# EAGLE design timer_rele (EAGLE 7.2.0)
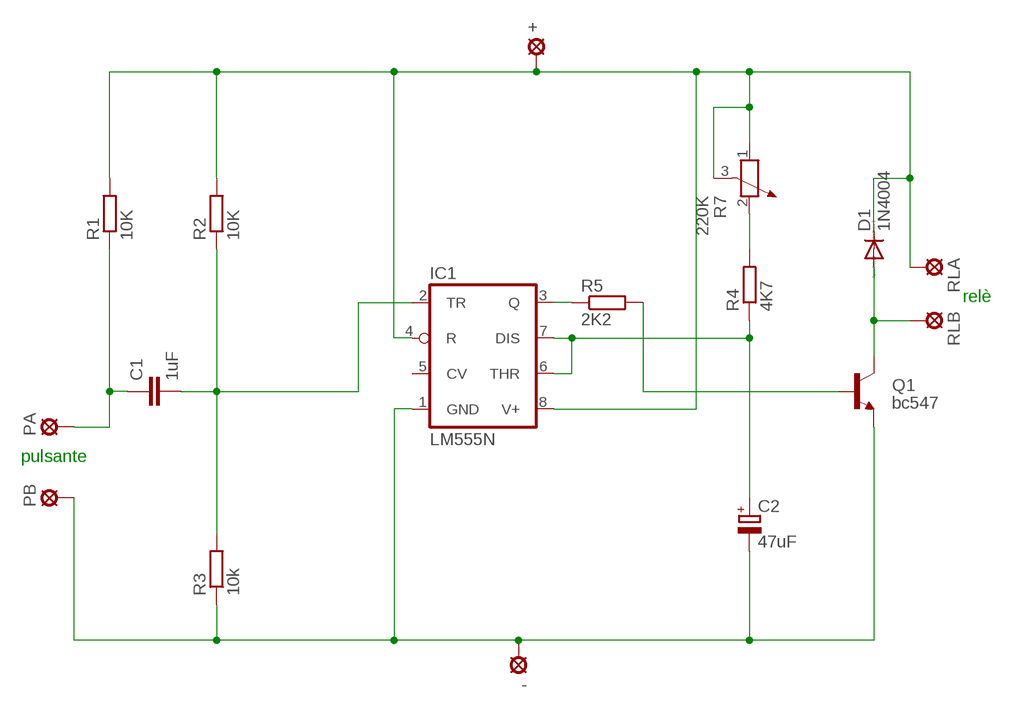
[diagram p0: schematic, sheet 1]

## Parts
+  LSP10  [LSP10]
-  LSP10  [LSP10]
C1  1uF  C-EU050-030X075  [C050-030X075]
C2  47uF  CPOL-EUE2-5  [E2-5]
D1  1N4004  [DO41-10]
IC1  LM555N  [DIL08]
PA  LSP10  [LSP10]
PB  LSP10  [LSP10]
Q1  bc547  TRANSISTOR_NPNBC547  [TO-92-AMMO]
R1  10K  R-EU_0207/10  [0207/10]
R2  10K  R-EU_0207/10  [0207/10]
R3  10k  R-EU_0207/10  [0207/10]
R4  4K7  R-EU_0207/10  [0207/10]
R5  2K2  R-EU_0207/10  [0207/10]
R7  220K  POTENTIOMETER_PT-10  [PT-10]
RLA  LSP10  [LSP10]
RLB  LSP10  [LSP10]

## Nets
N$1: +.MP D1.C IC1.4(R) IC1.8(V+) R1.2 R2.2 R7.1 R7.3 RLA.MP
N$3: D1.A Q1.1(C) RLB.MP
N$4: -.MP C2.- IC1.1(GND) PB.MP Q1.3(E) R3.1
N$5: C1.1 PA.MP R1.1
N$6: C1.2 IC1.2(TR) R2.1 R3.2
N$7: IC1.3(Q) R5.1
N$8: Q1.2(B) R5.2
N$10: R4.2 R7.2
N$11: C2.+ IC1.6(THR) IC1.7(DIS) R4.1
Unconnected: IC1.5(CV)

## Notes on the sheet
- relè
- pulsante

## Library data of the parts
+ - PA PB RLA RLB = solpad:LSP10: SOLDER PAD drill 1.0 mm, distributor Buerklin, 12H555
C1 = rcl:C-EU: CAPACITOR, European symbol
C2 = rcl:CPOL-EU: POLARIZED CAPACITOR, European symbol
D1 = diode:1N4004: DIODE general purpose rectifier, 1 A
IC1 = linear:*555: TIMER
Q1 = SparkFun-DiscreteSemi:TRANSISTOR_NPN: Generic NPN BJT MMBT2222A - TRANS-08049 (SOT-23, 1A 40V) MPSA42 - TRANS-09116 (SOT-23, 500mA 300V) MMBT5088LT1G - TRANS-11160 (SOT-23, 50 mA 30V) BC547 - COM-08928 <http://www.sparkfun.com/products/8928> (TO-92 45V 100mA) (1.Collector 2.Base 3.Emitter) 2N3904 - COM-00521 <http://www.sparkfun.com/products/521> (TO-92 40V 200mA) (1.Emitter 2.Base 3.Collector) P2N2222A - COM-12852 <http://www.sparkfun.com/products/12852> (TO-92 40V 600mA) (1.Collector 2.Base 3.Emitter)
R1-R5 = rcl:R-EU_: RESISTOR, European symbol
R7 = rcl:POTENTIOMETER_: Potentiometer

## Board
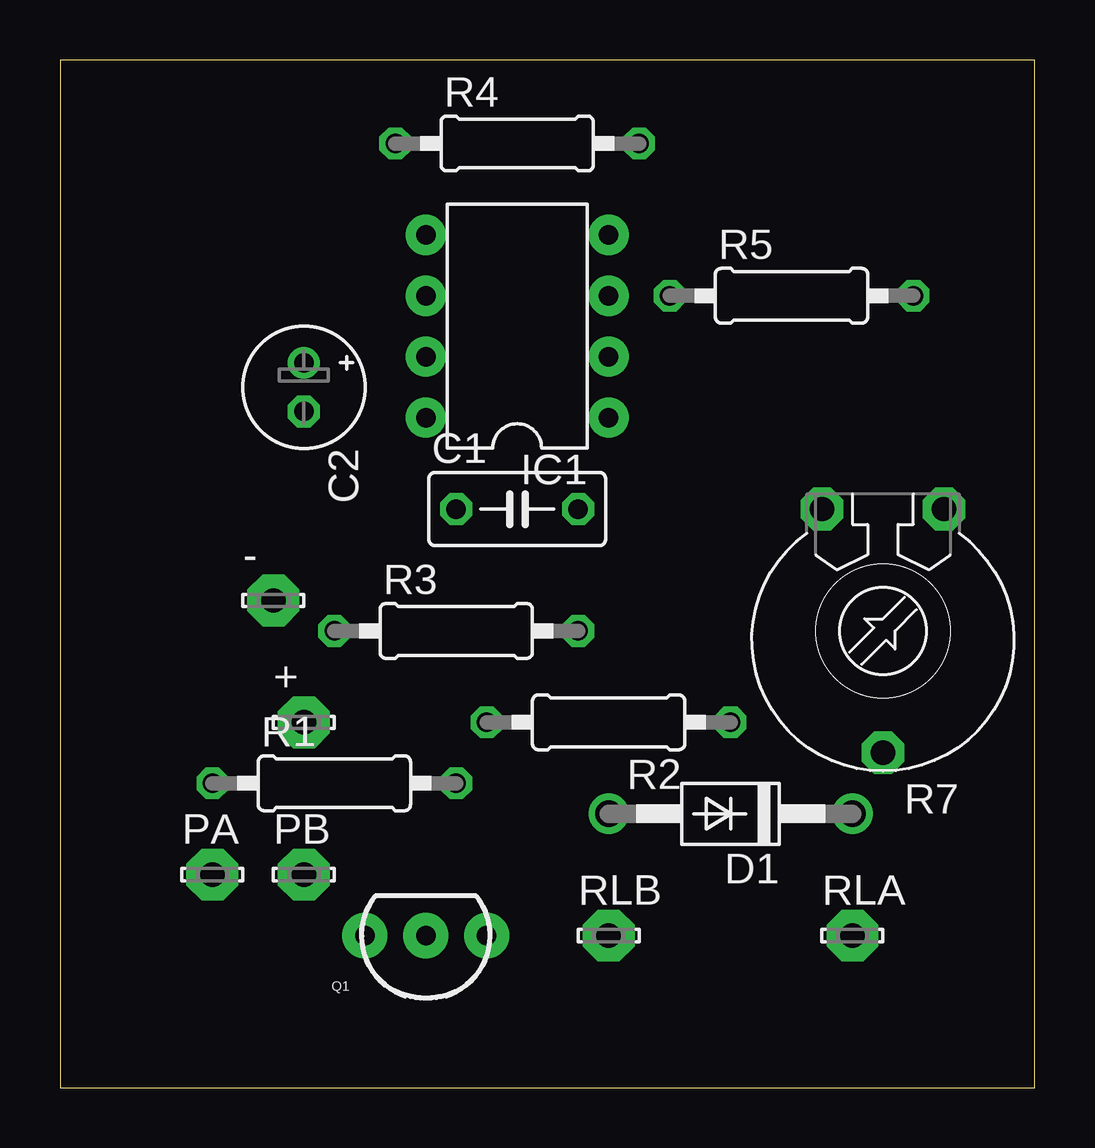
[diagram p1: board, top side]
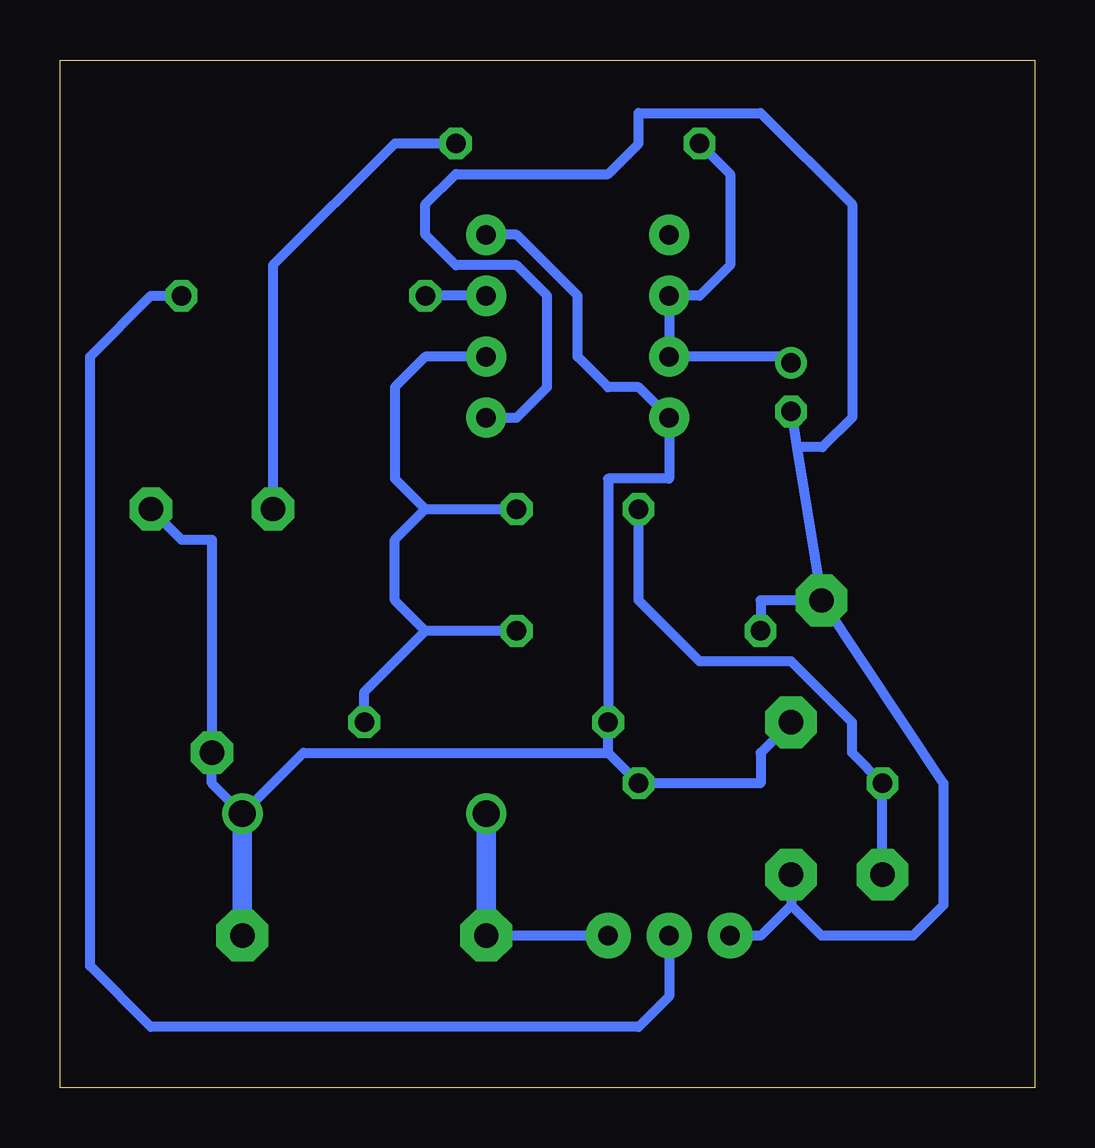
[diagram p2: board, bottom side, seen from below]

Size 40.62 x 42.85 mm. Coordinates in mm from the lower left corner, seen from the top.
Outline: 0,0 40.62,0 40.62,42.85 0,42.85 0,0
Copper layers (1*16): Top 0.035mm / dielectric 1.5mm / Bottom 0.035mm
Design rules "default": minimum track width 10mil, minimum drill 24mil, track to track 8mil, track to pad 8mil, pad to pad 8mil, via to via 8mil, smd to smd 8mil, copper to edge 40mil, drill to drill 8mil, minimum pad ring 10mil, minimum via ring 8mil, stop-mask expansion 4mil, vias tented up to drill 0mil, thermal gap 10mil

### Footprints (pad centres in the part's own frame; a part is rotated, then mirrored left to right if it is on the bottom)
LSP10 = drill 1.016 pad 2.159 octagon: MP 0,0
C050-030X075 = drill 0.813 octagon: 1 -2.54,0; 2 2.54,0
E2-5 = drill 0.813 pad 1.27: + -1.016,0 | drill 0.813 pad 1.27 octagon: - 1.016,0
DO41-10 = drill 1.118: A 5.08,0; C -5.08,0
DIL08 = drill 0.813 pad 1.676: 1 -3.81,-3.81; 2 -1.27,-3.81; 3 1.27,-3.81; 4 3.81,-3.81; 5 3.81,3.81; 6 1.27,3.81; 7 -1.27,3.81; 8 -3.81,3.81
TO-92-AMMO = drill 0.813 pad 1.88: 1 -2.54,0; 2 0,0; 3 2.54,0
0207/10 = drill 0.813 octagon: 1 -5.08,0; 2 5.08,0
PT-10 = drill 1.016 pad 1.778 octagon: 1 -2.54,-5.08; 2 2.54,-5.08; 3 0,5.08

### Placement (x,y rotation side)
+  10.16,15.24 0 top
-  8.89,20.32 0 top
C1  19.05,24.13 0 top
C2  10.16,29.21 270 top
D1  27.94,11.43 180 top
IC1  19.05,31.75 90 top
PA  6.35,8.89 0 top
PB  10.16,8.89 0 top
Q1  15.24,6.35 180 top
R1  11.43,12.7 0 top
R2  22.86,15.24 180 top
R3  16.51,19.05 0 top
R4  19.05,39.37 0 top
R5  30.48,33.02 0 top
R7  34.29,19.05 180 top
RLA  33.02,6.35 0 top
RLB  22.86,6.35 0 top

### Tracks (layer width: path | path; a pad name or v marks a point on that pad's centre or on a via)
N$1
  Bottom 0.406: 17.78,13.97 R1.2 11.43,12.7 11.43,13.97 +.MP | 17.78,13.97 R2.2 17.78,25.4 15.24,25.4 IC1.8 16.51,29.21 17.78,29.21 19.05,30.48 19.05,33.02 21.59,35.56 IC1.4 | R7.1 35.56,22.86 34.29,22.86 R7.3 34.29,12.7 D1.C 30.48,13.97 17.78,13.97
  Bottom 0.813: RLA.MP D1.C
N$3
  Bottom 0.406: Q1.1 RLB.MP
  Bottom 0.813: RLB.MP D1.A
N$4
  Bottom 0.406: PB.MP 10.16,7.62 | 10.16,7.62 11.43,6.35 Q1.3 | C2.- 9.92,26.71 | 9.92,26.71 -.MP | -.MP 3.81,12.7 3.81,7.62 5.08,6.35 8.89,6.35 10.16,7.62 | -.MP 11.43,20.32 R3.1 | IC1.1 21.59,27.94 20.32,29.21 20.32,33.02 21.59,34.29 24.13,34.29 25.4,35.56 25.4,36.83 24.13,38.1 17.78,38.1 16.51,39.37 16.51,40.64 11.43,40.64 7.62,36.83 7.62,27.94 8.85,26.71 9.92,26.71
N$5
  Bottom 0.406: PA.MP R1.1 7.62,13.97 7.62,15.24 10.16,17.78 13.97,17.78 16.51,20.32 C1.1
N$6
  Bottom 0.406: IC1.2 25.4,30.48 26.67,29.21 26.67,25.4 25.4,24.13 | 25.4,24.13 C1.2 | R3.2 25.4,19.05 | 25.4,19.05 26.67,20.32 26.67,22.86 25.4,24.13 | R2.1 27.94,16.51 25.4,19.05
N$7
  Bottom 0.406: IC1.3 R5.1
N$8
  Bottom 0.406: Q1.2 15.24,3.81 16.51,2.54 36.83,2.54 39.37,5.08 39.37,30.48 36.83,33.02 R5.2
N$10
  Bottom 0.406: R4.2 26.67,39.37 31.75,34.29 R7.2
N$11
  Bottom 0.406: C2.+ 10.41,30.48 IC1.7 IC1.6 13.97,33.02 12.7,34.29 12.7,38.1 R4.1